# EAGLE schematic pantalla (EAGLE 7.3.0)
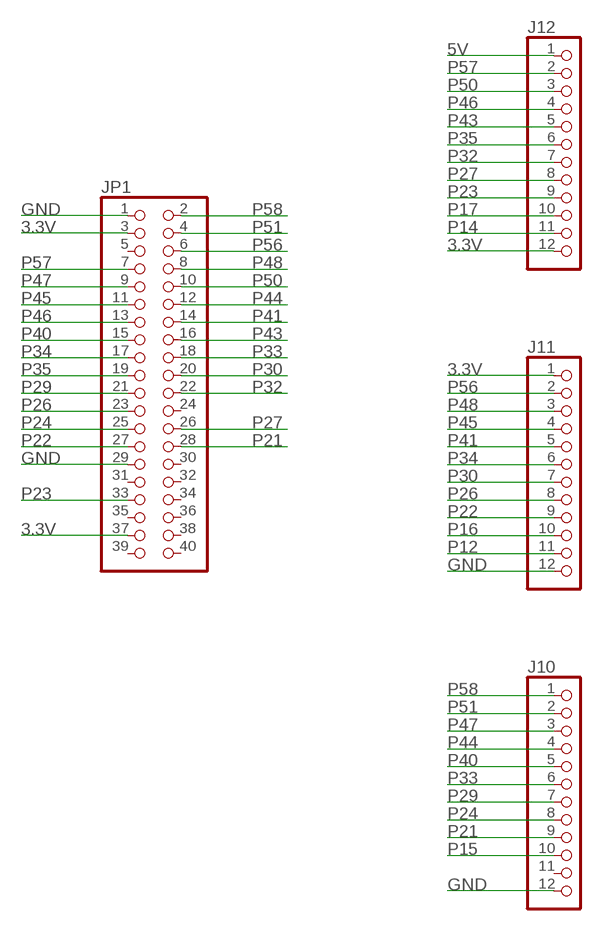
[diagram p0: schematic, sheet 1]

## Parts
J10  PINHD-1X12  [1X12]
J11  PINHD-1X12  [1X12]
J12  PINHD-1X12  [1X12]
JP1  PINHD-2X20  [2X20]

## Nets
3.3V: J11.1 J12.12 JP1.3 JP1.37
5V: J12.1
GND: J10.12 J11.12 JP1.1 JP1.29
P12: J11.11
P14: J12.11
P15: J10.10
P16: J11.10
P17: J12.10
P21: J10.9 JP1.28
P22: J11.9 JP1.27
P23: J12.9 JP1.33
P24: J10.8 JP1.25
P26: J11.8 JP1.23
P27: J12.8 JP1.26
P29: J10.7 JP1.21
P30: J11.7 JP1.20
P32: J12.7 JP1.22
P33: J10.6 JP1.18
P34: J11.6 JP1.17
P35: J12.6 JP1.19
P40: J10.5 JP1.15
P41: J11.5 JP1.14
P43: J12.5 JP1.16
P44: J10.4 JP1.12
P45: J11.4 JP1.11
P46: J12.4 JP1.13
P47: J10.3 JP1.9
P48: J11.3 JP1.8
P50: J12.3 JP1.10
P51: J10.2 JP1.4
P56: J11.2 JP1.6
P57: J12.2 JP1.7
P58: J10.1 JP1.2
Unconnected: J10.11 JP1.5 JP1.24 JP1.30 JP1.31 JP1.32 JP1.34 JP1.35 JP1.36 JP1.38 JP1.39 JP1.40

## Library data of the parts
J10-J12 = pinhead:PINHD-1X12: PIN HEADER
JP1 = pinhead:PINHD-2X20: PIN HEADER